# Altium project DARKYDEN.PrjPcb (part 6 of 14)

## Sheet CONNECTEUR_4.SchDoc: DARKYDEN_CONNECTEUR_4
size Letter; ApprovedBy: APPROUVÉ PAR; Author: Harold Malbrouck; Organization: Cegep Limoilou; Address1: 1300, 8e Avenue; Address2: Québec, QC; Address3: Canada; Address4: G1J 5L5; Revision: Rev.B; SheetNumber: 14; SheetTotal: 22
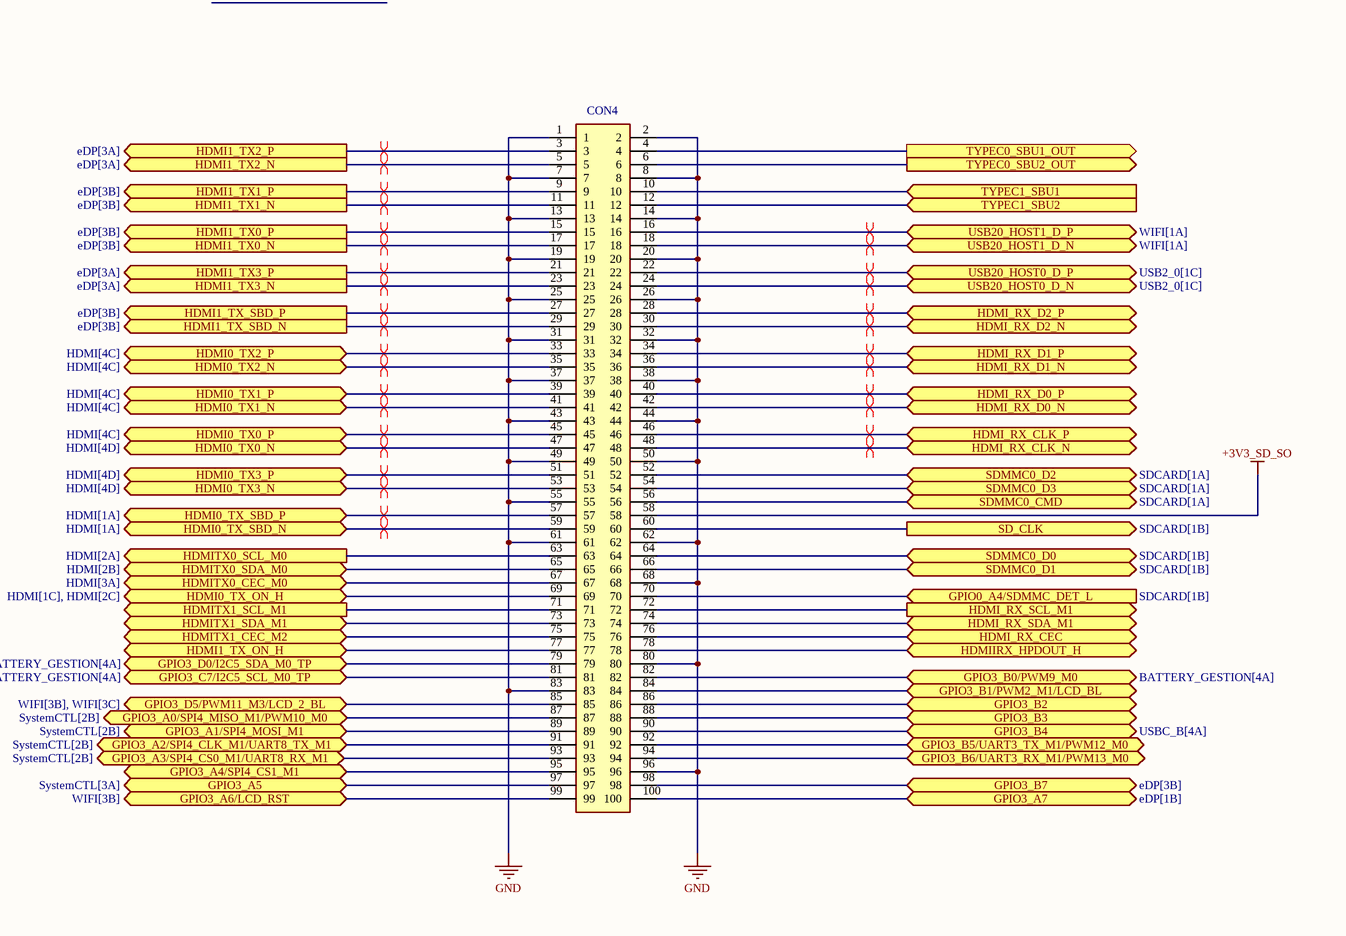
[diagram p8: CONNECTEUR_4.SchDoc, right]

### Parts
CON4  DF40HC  [DF40HC30100DS04V51]  (value not drawn)

### Ports
GPIO0_A4/SDMMC_DET_L (in, see SDCARD[1B]), GPIO3_A0/SPI4_MISO_M1/PWM10_M0 (bidir, see SystemCTL[2B]), GPIO3_A1/SPI4_MOSI_M1 (bidir, see SystemCTL[2B]), GPIO3_A2/SPI4_CLK_M1/UART8_TX_M1 (bidir, see SystemCTL[2B]), GPIO3_A3/SPI4_CS0_M1/UART8_RX_M1 (bidir, see SystemCTL[2B]), GPIO3_A4/SPI4_CS1_M1 (bidir), GPIO3_A5 (bidir, see SystemCTL[3A]), GPIO3_A6/LCD_RST (bidir, see WIFI[3B]), GPIO3_A7 (bidir, see eDP[1B]), GPIO3_B0/PWM9_M0 (bidir, see BATTERY_GESTION[4A]), GPIO3_B1/PWM2_M1/LCD_BL (bidir), GPIO3_B2 (bidir), GPIO3_B3 (bidir), GPIO3_B4 (bidir, see USBC_B[4A]), GPIO3_B5/UART3_TX_M1/PWM12_M0 (bidir), GPIO3_B6/UART3_RX_M1/PWM13_M0 (bidir), GPIO3_B7 (bidir, see eDP[3B]), GPIO3_C7/I2C5_SCL_M0_TP (bidir, see BATTERY_GESTION[4A]), GPIO3_D0/I2C5_SDA_M0_TP (bidir, see BATTERY_GESTION[4A]), GPIO3_D5/PWM11_M3/LCD_2_BL (bidir, see WIFI[3B], WIFI[3C]), HDMI0_TX0_N (bidir, see HDMI[4D]), HDMI0_TX0_P (bidir, see HDMI[4C]), HDMI0_TX1_N (bidir, see HDMI[4C]), HDMI0_TX1_P (bidir, see HDMI[4C]), HDMI0_TX2_N (bidir, see HDMI[4C]), HDMI0_TX2_P (bidir, see HDMI[4C]), HDMI0_TX3_N (bidir, see HDMI[4D]), HDMI0_TX3_P (bidir, see HDMI[4D]), HDMI0_TX_ON_H (bidir, see HDMI[1C], HDMI[2C]), HDMI0_TX_SBD_N (bidir, see HDMI[1A]), HDMI0_TX_SBD_P (bidir, see HDMI[1A]), HDMI1_TX0_N (out, see eDP[3B]), HDMI1_TX0_P (out, see eDP[3B]), HDMI1_TX1_N (out, see eDP[3B]), HDMI1_TX1_P (out, see eDP[3B]), HDMI1_TX2_N (out, see eDP[3A]), HDMI1_TX2_P (out, see eDP[3A]), HDMI1_TX3_N (out, see eDP[3A]), HDMI1_TX3_P (out, see eDP[3A]), HDMI1_TX_ON_H (bidir), HDMI1_TX_SBD_N (out, see eDP[3B]), HDMI1_TX_SBD_P (out, see eDP[3B]), HDMI_RX_CEC (bidir), HDMI_RX_CLK_N (bidir), HDMI_RX_CLK_P (bidir), HDMI_RX_D0_N (bidir), HDMI_RX_D0_P (bidir), HDMI_RX_D1_N (bidir), HDMI_RX_D1_P (bidir), HDMI_RX_D2_N (bidir), HDMI_RX_D2_P (bidir), HDMI_RX_SCL_M1 (out), HDMI_RX_SDA_M1 (bidir), HDMIIRX_HPDOUT_H (bidir), HDMITX0_CEC_M0 (bidir, see HDMI[3A]), HDMITX0_SCL_M0 (out, see HDMI[2A]), HDMITX0_SDA_M0 (bidir, see HDMI[2B]), HDMITX1_CEC_M2 (bidir), HDMITX1_SCL_M1 (out), HDMITX1_SDA_M1 (bidir), SD_CLK (out, see SDCARD[1B]), SDMMC0_CMD (bidir, see SDCARD[1A]), SDMMC0_D0 (bidir, see SDCARD[1B]), SDMMC0_D1 (bidir, see SDCARD[1B]), SDMMC0_D2 (bidir, see SDCARD[1A]), SDMMC0_D3 (bidir, see SDCARD[1A]), TYPEC0_SBU1_OUT (out), TYPEC0_SBU2_OUT (out), TYPEC1_SBU1 (in), TYPEC1_SBU2 (in), USB20_HOST0_D_N (bidir, see USB2_0[1C]), USB20_HOST0_D_P (bidir, see USB2_0[1C]), USB20_HOST1_D_N (bidir, see WIFI[1A]), USB20_HOST1_D_P (bidir, see WIFI[1A])

### Nets
+3V3_SD_SO: CON4.58
GND: CON4.1 CON4.2 CON4.7 CON4.8 CON4.13 CON4.14 CON4.19 CON4.20 CON4.25 CON4.26 CON4.31 CON4.32 CON4.37 CON4.38 CON4.43 CON4.44 CON4.49 CON4.50 CON4.55 CON4.61 CON4.62 CON4.68 CON4.80 CON4.83 CON4.96  [project net PACK-]
GPIO0_A4/SDMMC_DET_L: CON4.70 ; port GPIO0_A4/SDMMC_DET_L
GPIO3_A0/SPI4_MISO_M1/PWM10_M0: CON4.87 ; port GPIO3_A0/SPI4_MISO_M1/PWM10_M0
GPIO3_A1/SPI4_MOSI_M1: CON4.89 ; port GPIO3_A1/SPI4_MOSI_M1
GPIO3_A2/SPI4_CLK_M1/UART8_TX_M1: CON4.91 ; port GPIO3_A2/SPI4_CLK_M1/UART8_TX_M1
GPIO3_A3/SPI4_CS0_M1/UART8_RX_M1: CON4.93 ; port GPIO3_A3/SPI4_CS0_M1/UART8_RX_M1
GPIO3_A4/SPI4_CS1_M1: CON4.95 ; port GPIO3_A4/SPI4_CS1_M1
GPIO3_A5: CON4.97 ; port GPIO3_A5
GPIO3_A6/LCD_RST: CON4.99 ; port GPIO3_A6/LCD_RST
GPIO3_A7: CON4.100 ; port GPIO3_A7
GPIO3_B0/PWM9_M0: CON4.82 ; port GPIO3_B0/PWM9_M0
GPIO3_B1/PWM2_M1/LCD_BL: CON4.84 ; port GPIO3_B1/PWM2_M1/LCD_BL
GPIO3_B2: CON4.86 ; port GPIO3_B2
GPIO3_B3: CON4.88 ; port GPIO3_B3
GPIO3_B4: CON4.90 ; port GPIO3_B4
GPIO3_B5/UART3_TX_M1/PWM12_M0: CON4.92 ; port GPIO3_B5/UART3_TX_M1/PWM12_M0
GPIO3_B6/UART3_RX_M1/PWM13_M0: CON4.94 ; port GPIO3_B6/UART3_RX_M1/PWM13_M0
GPIO3_B7: CON4.98 ; port GPIO3_B7
GPIO3_C7/I2C5_SCL_M0_TP: CON4.81 ; port GPIO3_C7/I2C5_SCL_M0_TP
GPIO3_D0/I2C5_SDA_M0_TP: CON4.79 ; port GPIO3_D0/I2C5_SDA_M0_TP
GPIO3_D5/PWM11_M3/LCD_2_BL: CON4.85 ; port GPIO3_D5/PWM11_M3/LCD_2_BL
HDMI0_TX0_N: CON4.47 ; port HDMI0_TX0_N
HDMI0_TX0_P: CON4.45 ; port HDMI0_TX0_P
HDMI0_TX1_N: CON4.41 ; port HDMI0_TX1_N
HDMI0_TX1_P: CON4.39 ; port HDMI0_TX1_P
HDMI0_TX2_N: CON4.35 ; port HDMI0_TX2_N
HDMI0_TX2_P: CON4.33 ; port HDMI0_TX2_P
HDMI0_TX3_N: CON4.53 ; port HDMI0_TX3_N
HDMI0_TX3_P: CON4.51 ; port HDMI0_TX3_P
HDMI0_TX_ON_H: CON4.69 ; port HDMI0_TX_ON_H
HDMI0_TX_SBD_N: CON4.59 ; port HDMI0_TX_SBD_N
HDMI0_TX_SBD_P: CON4.57 ; port HDMI0_TX_SBD_P
HDMI1_TX0_N: CON4.17 ; port HDMI1_TX0_N
HDMI1_TX0_P: CON4.15 ; port HDMI1_TX0_P
HDMI1_TX1_N: CON4.11 ; port HDMI1_TX1_N
HDMI1_TX1_P: CON4.9 ; port HDMI1_TX1_P
HDMI1_TX2_N: CON4.5 ; port HDMI1_TX2_N
HDMI1_TX2_P: CON4.3 ; port HDMI1_TX2_P
HDMI1_TX3_N: CON4.23 ; port HDMI1_TX3_N
HDMI1_TX3_P: CON4.21 ; port HDMI1_TX3_P
HDMI1_TX_ON_H: CON4.77 ; port HDMI1_TX_ON_H
HDMI1_TX_SBD_N: CON4.29 ; port HDMI1_TX_SBD_N
HDMI1_TX_SBD_P: CON4.27 ; port HDMI1_TX_SBD_P
HDMI_RX_CEC: CON4.76 ; port HDMI_RX_CEC
HDMI_RX_CLK_N: CON4.48 ; port HDMI_RX_CLK_N
HDMI_RX_CLK_P: CON4.46 ; port HDMI_RX_CLK_P
HDMI_RX_D0_N: CON4.42 ; port HDMI_RX_D0_N
HDMI_RX_D0_P: CON4.40 ; port HDMI_RX_D0_P
HDMI_RX_D1_N: CON4.36 ; port HDMI_RX_D1_N
HDMI_RX_D1_P: CON4.34 ; port HDMI_RX_D1_P
HDMI_RX_D2_N: CON4.30 ; port HDMI_RX_D2_N
HDMI_RX_D2_P: CON4.28 ; port HDMI_RX_D2_P
HDMI_RX_SCL_M1: CON4.72 ; port HDMI_RX_SCL_M1
HDMI_RX_SDA_M1: CON4.74 ; port HDMI_RX_SDA_M1
HDMIIRX_HPDOUT_H: CON4.78 ; port HDMIIRX_HPDOUT_H
HDMITX0_CEC_M0: CON4.67 ; port HDMITX0_CEC_M0
HDMITX0_SCL_M0: CON4.63 ; port HDMITX0_SCL_M0
HDMITX0_SDA_M0: CON4.65 ; port HDMITX0_SDA_M0
HDMITX1_CEC_M2: CON4.75 ; port HDMITX1_CEC_M2
HDMITX1_SCL_M1: CON4.71 ; port HDMITX1_SCL_M1
HDMITX1_SDA_M1: CON4.73 ; port HDMITX1_SDA_M1
SD_CLK: CON4.60 ; port SD_CLK
SDMMC0_CMD: CON4.56 ; port SDMMC0_CMD
SDMMC0_D0: CON4.64 ; port SDMMC0_D0
SDMMC0_D1: CON4.66 ; port SDMMC0_D1
SDMMC0_D2: CON4.52 ; port SDMMC0_D2
SDMMC0_D3: CON4.54 ; port SDMMC0_D3
TYPEC0_SBU1_OUT: CON4.4 ; port TYPEC0_SBU1_OUT
TYPEC0_SBU2_OUT: CON4.6 ; port TYPEC0_SBU2_OUT
TYPEC1_SBU1: CON4.10 ; port TYPEC1_SBU1
TYPEC1_SBU2: CON4.12 ; port TYPEC1_SBU2
USB20_HOST1_D_N: CON4.18 ; port USB20_HOST1_D_N
USB20_HOST1_D_P: CON4.16 ; port USB20_HOST1_D_P
usb_N: CON4.24 ; port USB20_HOST0_D_N
usb_P: CON4.22 ; port USB20_HOST0_D_P

### Layout directives
differential pair: HDMI0_TX0_N, HDMI0_TX0_P, HDMI0_TX1_N, HDMI0_TX1_P, HDMI0_TX2_N, HDMI0_TX2_P, HDMI0_TX3_N, HDMI0_TX3_P, HDMI0_TX_SBD_N, HDMI0_TX_SBD_P, HDMI1_TX0_N, HDMI1_TX0_P, HDMI1_TX1_N, HDMI1_TX1_P, HDMI1_TX2_N, HDMI1_TX2_P, HDMI1_TX3_N, HDMI1_TX3_P, HDMI1_TX_SBD_N, HDMI1_TX_SBD_P, HDMI_RX_CLK_N, HDMI_RX_CLK_P, HDMI_RX_D0_N, HDMI_RX_D0_P, HDMI_RX_D1_N, HDMI_RX_D1_P, HDMI_RX_D2_N, HDMI_RX_D2_P, USB20_HOST1_D_N, USB20_HOST1_D_P, usb_N, usb_P

### Notes on the sheet
- Titre :
- Conception :
- Date :
- Approbation :
- Heure :
- Révision :
- Feuille
- de
- Fichier :

### Library data of the parts
CON4 = DF40HC(3.0)-100DS-0.4V(51): Stacking Board Connector, DF40 Series, Receptacle, 0.4 mm, 100, Surface Mount, G; Manufacturer_Name: Hirose; Number of Positions: 100; Contact Resistance: 90mR; Contact Voltage Rating (AC): 30V; Current Rating: 300mA; Mated Stacking Heights: 3mm; Contact Pitch: 400um; Datasheet Link: https://componentsearchengine.com/Datasheets/1/DF40HC(3.0)-100DS-0.4V(51.pdf; Height: 3.05mm; Manufacturer_Part_Number: DF40HC(3.0)-100DS-0.4V(51; Mouser Part Number: 798-DF40HC30100DS451; Mouser Price/Stock: https://www.mouser.co.uk/ProductDetail/Hirose-Connector/DF40HC3.0-100DS-0.4V51?qs=%252BAZVS4b%2FkgIV%252B3vHYy2dCA%3D%3D; Arrow Part Number: DF40HC(3.0)-100DS-0.4V(51; Arrow Price/Stock: https://www.arrow.com/en/products/df40hc-3.0-100ds-0.4v-51/hirose-electric; Supplier: Digikey; Supplier Part Number: 26-DF40HC(3.0)-100DS-0.4V(51)CT-ND; Manufacturer: Hirose; Manufacturer Part Number: DF40HC(3.0)-100DS-0.4V(51; RoHS: Yes; Category: Headers and Wire Housings; Stock: 5604; Pricing: 1=2.61, 10=2.219, 25=2.0796, 50=1.9804, 100=1.8858, 250=1.76764, 500=1.68326, 1000=1.6524 (USD); Mounting Technology: Surface Mount; Contact Plating: Gold; Contact Material: Nickel,Gold; Housing Color: Black; Min Operating Temperature: -35°C; Max Operating Temperature: 85°C; Package Quantity: 3000; Packaging: Tape and Reel; Number of Rows: 2; Connector Type: Receptacle; Series: DF40; Contact Voltage Rating (DC): 30V; Number of Contacts: 100; Orientation: Straight; Voltage Rating: 30V; Length: 22.6mm; Width: 3.38mm; ComponentLink1URL: https://datasheet.ciiva.com/13559/ed-df40-20140305-13559540.pdf?src-supplier=Mouser; ComponentLink1Description: https://datasheet.ciiva.com/13559/ed-df40-20140305-13559540.pdf?src-supplier=Mouser

## Sheet POWERSYSTEM.SchDoc: DARKYDEN_POWERSYSTEM
size Letter; ApprovedBy: APPROUVÉ PAR; Author: Harold Malbrouck; Organization: Cegep Limoilou; Address1: 1300, 8e Avenue; Address2: Québec, QC; Address3: Canada; Address4: G1J 5L5; Revision: Rev.A; SheetNumber: 17; SheetTotal: 22
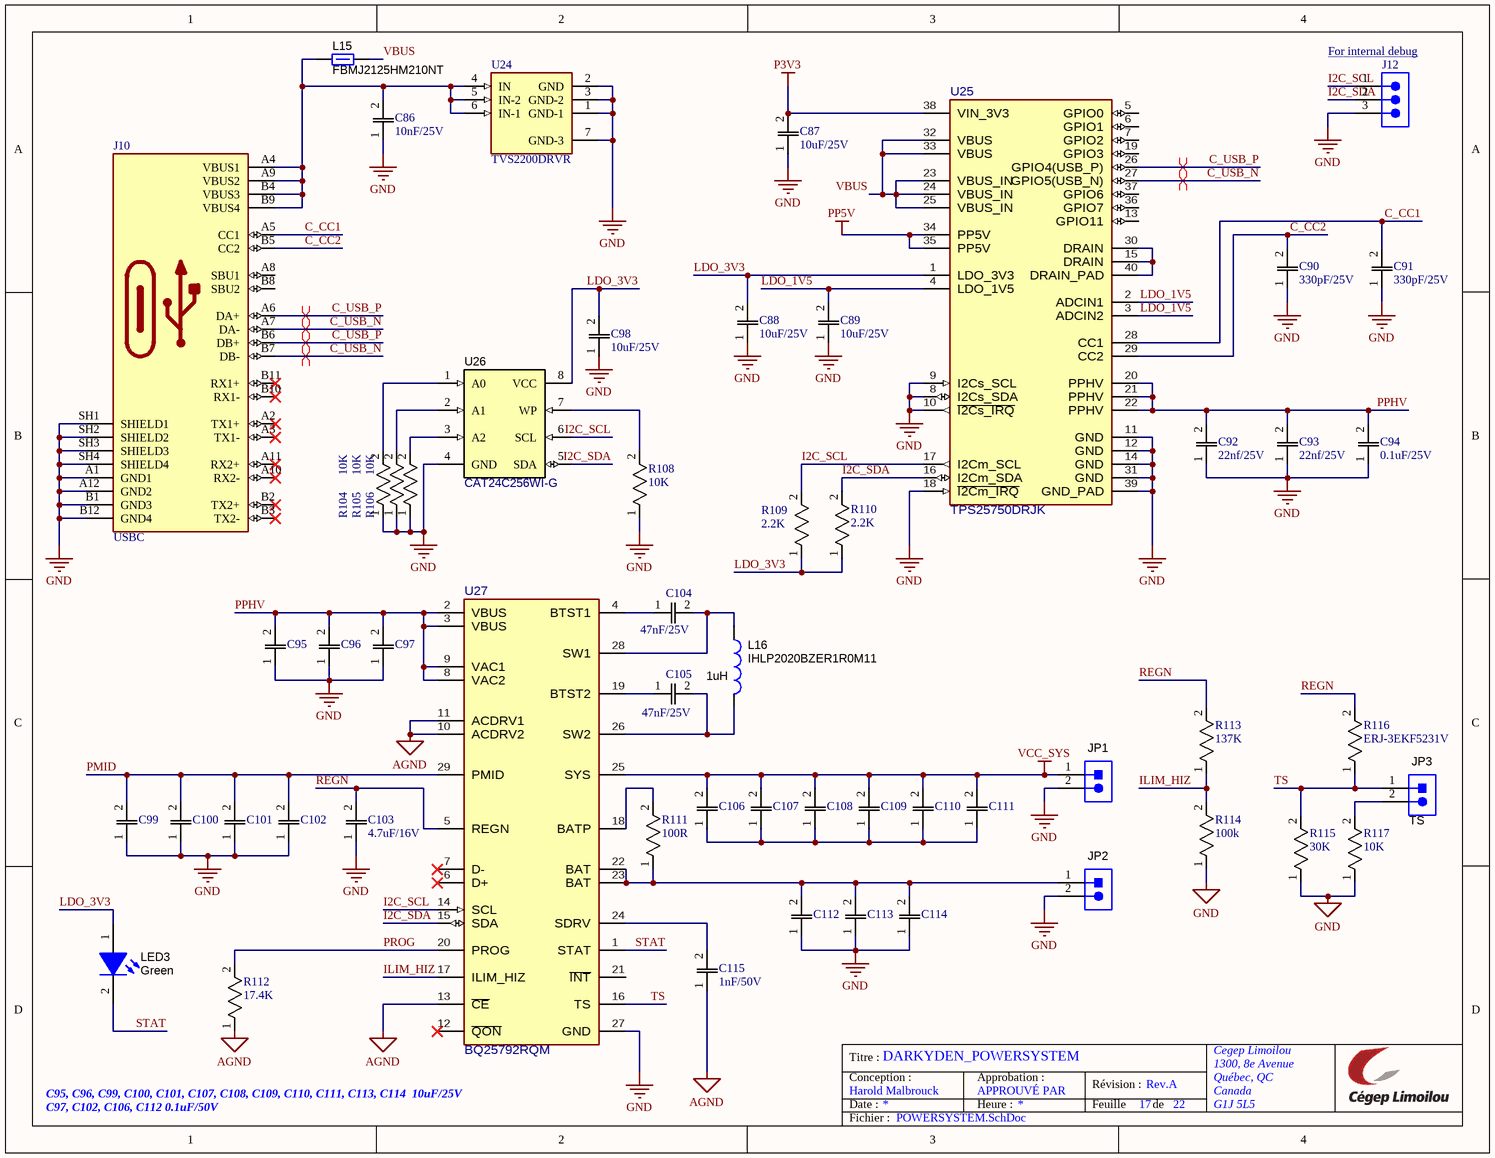
[diagram p9: POWERSYSTEM.SchDoc]

### Parts
C86  10nF/25V  [C0805]
C87  10uF/25V  [CAPC220145_88N_KEM]
C88  10uF/25V  [CAPC220145_88N_KEM]
C89  10uF/25V  [CAPC220145_88N_KEM]
C90  330pF/25V  [C0805]
C91  330pF/25V  [C0805]
C92  22nf/25V  [C0805]
C93  22nf/25V  [C0805]
C94  0.1uF/25V  [CAPC220145_88N_KEM]
C95  10uF/25V  [CAPC220145_88N_KEM]  (value not drawn)
C96  10uF/25V  [CAPC220145_88N_KEM]  (value not drawn)
C97  0.1uF/50V  [C0805]  (value not drawn)
C98  10uF/25V  [CAPC220145_88N_KEM]
C99  10uF/25V  [CAPC220145_88N_KEM]  (value not drawn)
C100  10uF/25V  [CAPC220145_88N_KEM]  (value not drawn)
C101  10uF/25V  [CAPC220145_88N_KEM]  (value not drawn)
C102  0.1uF/50V  [C0805]  (value not drawn)
C103  4.7uF/16V  [C0805]
C104  47nF/25V  [C0805]
C105  47nF/25V  [C0805]
C106  0.1uF/50V  [C0805]  (value not drawn)
C107  10uF/25V  [CAPC220145_88N_KEM]  (value not drawn)
C108  10uF/25V  [CAPC220145_88N_KEM]  (value not drawn)
C109  10uF/25V  [CAPC220145_88N_KEM]  (value not drawn)
C110  10uF/25V  [CAPC220145_88N_KEM]  (value not drawn)
C111  10uF/25V  [CAPC220145_88N_KEM]  (value not drawn)
C112  0.1uF/50V  [C0805]  (value not drawn)
C113  10uF/25V  [CAPC220145_88N_KEM]  (value not drawn)
C114  10uF/25V  [CAPC220145_88N_KEM]  (value not drawn)
C115  1nF/50V  [CAPC2012X88N]
J10  USBC  [MOLEX_2012670005]
J12  61300311121  [61300311121]  (value not drawn)
JP1  Header_2x1  [CONN_PEC02SAAN]  (value not drawn)
JP2  Header_2x1  [CONN_PEC02SAAN]  (value not drawn)
JP3  TS  [CONN_PEC02SAAN]
L15  FBMJ2125HM210NT  [0805_HV]
L16  IHLP2020BZER1R0M11  ValueDisplayed: 1uH  [IHLP-2020BZ]
LED3  value Green  [LED_LTST-C190]  (hidden comment: LTST-C190GKT)
R104  10K  [ERJ3EKF1000V]
R105  10K  [ERJ3EKF1000V]
R106  10K  [ERJ3EKF1000V]
R108  10K  [ERJ3EKF1000V]
R109  2.2K  [ERJ3EKF1000V]
R110  2.2K  [ERJ3EKF1000V]
R111  100R  [RESC1608X55N]
R112  17.4K  [RESC1608X55N]
R113  137K  [RESC1608X55N]
R114  100k  [ERJ3EKF1000V]
R115  30K  [ERJ3EKF1000V]
R116  ERJ-3EKF5231V  [RESC1608X55N]
R117  10K  [ERJ3EKF1000V]
U24  TVS2200DRVR  [SON65P200X200X80-7N]
U25  TPS25750DRJK  [RJK0038B-C01-MFG]
U26  CAT24C256WI-G  [SOIC-8]
U27  BQ25792RQM  [RQM0029A-MFG]

### Nets
AGND: C115.1 R112.1 U27.10(ACDRV2) U27.11(ACDRV1) U27.13(~{CE})
GND: C86.1 C87.1 C88.1 C89.1 C90.1 C91.1 C92.1 C93.1 C94.1 C95.1 C96.1 C97.1 C98.1 C99.1 C100.1 C101.1 C102.1 C103.1 C112.1 C113.1 C114.1 J10.A1(GND1) J10.A12(GND2) J10.B1(GND3) J10.B12(GND4) J10.SH1(SHIELD1) J10.SH2(SHIELD2) J10.SH3(SHIELD3) J10.SH4(SHIELD4) J12.3 JP1.2 JP2.2 R104.1 R105.1 R106.1 R108.1 R114.1 R115.1 R117.1 U24.1(GND-1) U24.2(GND) U24.3(GND-2) U24.7(GND-3) U25.8(I2Cs_SDA) U25.9(I2Cs_SCL) U25.10(~{I2Cs_IRQ}) U25.11(GND) U25.12(GND) U25.14(GND) U25.18(~{I2Cm_IRQ}) U25.31(GND) U25.39(GND_PAD) U26.4(GND) U27.27(GND)  [project net PACK-]
P3V3: C87.2 U25.38(VIN_3V3)
PP5V: U25.34(PP5V) U25.35(PP5V)
VCC_SYS: C106.2 C107.2 C108.2 C109.2 C110.2 C111.2 JP1.1 U27.25(SYS)
C_CC1: C91.2 J10.A5(CC1) U25.28(CC1)
C_CC2: C90.2 J10.B5(CC2) U25.29(CC2)
C_USB_N: J10.A7(DA-) J10.B7(DB-) U25.27(GPIO5(USB_N))
C_USB_P: J10.A6(DA+) J10.B6(DB+) U25.26(GPIO4(USB_P))
I2C_SCL: J12.1 R109.2 U25.17(I2Cm_SCL) U26.6(SCL) U27.14(SCL)
I2C_SDA: J12.2 R110.2 U25.16(I2Cm_SDA) U26.5(SDA) U27.15(SDA)
ILIM_HIZ: R113.1 R114.2 U27.17(ILIM_HIZ)
LDO_1V5: C89.2 U25.2(ADCIN1) U25.3(ADCIN2) U25.4(LDO_1V5)
LDO_3V3: C88.2 C98.2 LED3.1(A) R109.1 R110.1 U25.1(LDO_3V3) U26.8(VCC)
PMID: C99.2 C100.2 C101.2 C102.2 U27.29(PMID)
PPHV: C92.2 C93.2 C94.2 C95.2 C96.2 C97.2 U25.20(PPHV) U25.21(PPHV) U25.22(PPHV) U27.2(VBUS) U27.3(VBUS) U27.8(VAC2) U27.9(VAC1)
PROG: R112.2 U27.20(PROG)
REGN: C103.2 R113.2 R116.2 U27.5(REGN)
STAT: LED3.2(K) U27.1(STAT)
TS: JP3.1 R115.2 R116.1 U27.16(TS)
VBUS: L15.2 U25.23(VBUS_IN) U25.24(VBUS_IN) U25.25(VBUS_IN) U25.32(VBUS) U25.33(VBUS)
NetC86_2: C86.2 J10.A4(VBUS1) J10.A9(VBUS2) J10.B4(VBUS3) J10.B9(VBUS4) L15.1 U24.4(IN) U24.5(IN-2) U24.6(IN-1)
NetC104_1: C104.1 U27.4(BTST1)
NetC104_2: C104.2 L16.1 U27.28(SW1)
NetC105_1: C105.1 U27.19(BTST2)
NetC105_2: C105.2 L16.2 U27.26(SW2)
NetC106_1: C106.1 C107.1 C108.1 C109.1 C110.1 C111.1
NetC112_2: C112.2 C113.2 C114.2 JP2.1 R111.1 U27.22(BAT) U27.23(BAT)
NetC115_2: C115.2 U27.24(SDRV)
NetJP3_2: JP3.2 R117.2
NetR104_2: R104.2 U26.1(A0)
NetR105_2: R105.2 U26.2(A1)
NetR106_2: R106.2 U26.3(A2)
NetR108_2: R108.2 U26.7(WP)
NetR111_2: R111.2 U27.18(BATP)
NetU25_15: U25.15(DRAIN) U25.30(DRAIN) U25.40(DRAIN_PAD)

Not connected (* = marked no-connect by the designer): J10 A2(TX1+)* A3(TX1-)* A8(SBU1) A10(RX2-)* A11(RX2+)* B2(TX2+)* B3(TX2-)* B8(SBU2) B10(RX1-)* B11(RX1+)*; U25 5(GPIO0) 6(GPIO1) 7(GPIO2) 13(GPIO11) 19(GPIO3) 36(GPIO7) 37(GPIO6); U27 6(D+)* 7(D-)* 12(~{QON})* 21(~{INT})

### Layout directives
differential pair: C_USB_N, C_USB_P

### Notes on the sheet
- (near J12) For internal debug
- C95, C96, C99, C100, C101, C107, C108, C109, C110, C111, C113, C114  10uF/25V
  C97, C102, C106, C112 0.1uF/50V
- Titre :
- Conception :
- Date :
- Approbation :
- Heure :
- Révision :
- Feuille
- de
- Fichier :